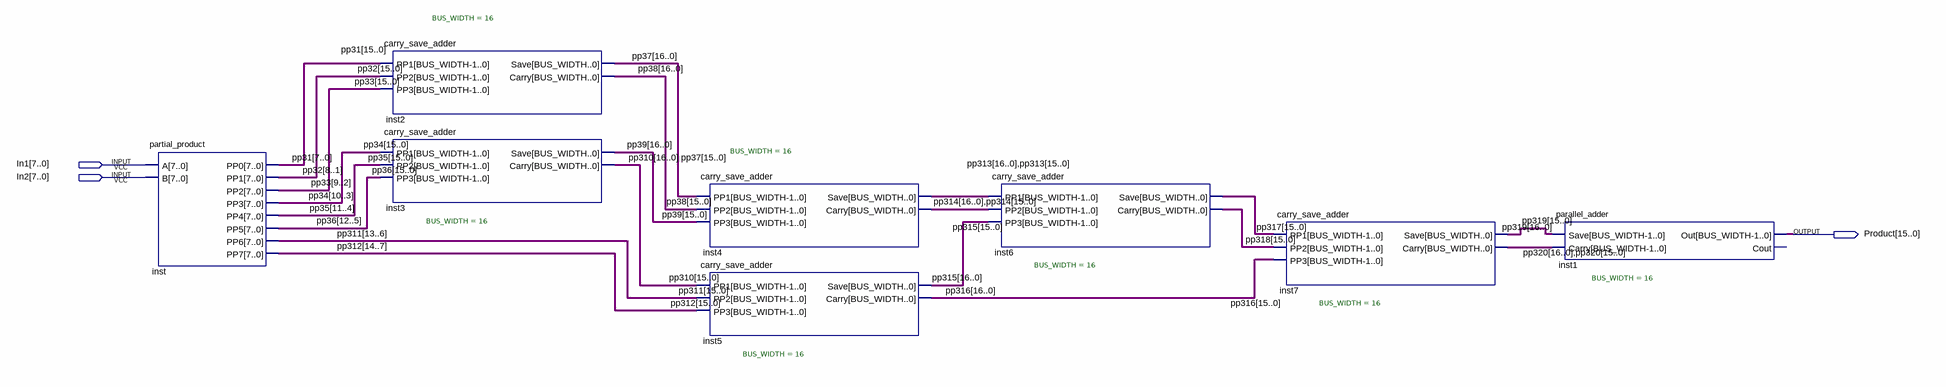
[diagram p0: schematic sheet]
// Quartus schematic wallace.bdf as structural Verilog: 8 symbols, 3 pins
module wallace (
  input  [7:0] In1,
  input  [7:0] In2,
  output [15:0] Product
);

  wire [15:0] pp31, pp32, pp33, pp34, pp35, pp36, pp311, pp312, pp317, pp318;
  wire [16:0] pp37, pp38, pp39, pp310, pp313, pp314, pp315, pp316, pp319, pp320;

  partial_product inst (
    .A(In1), .B(In2), .PP0(pp31[7:0]), .PP1(pp32[8:1]), .PP2(pp33[9:2]), .PP3(pp34[10:3]), .PP4(pp35[11:4]),
    .PP5(pp36[12:5]), .PP6(pp311[13:6]), .PP7(pp312[14:7]));
  carry_save_adder #(.BUS_WIDTH(16)) inst2 (.PP1(pp31), .PP2(pp32), .PP3(pp33), .Save(pp37), .Carry(pp38));
  carry_save_adder #(.BUS_WIDTH(16)) inst3 (.PP1(pp34), .PP2(pp35), .PP3(pp36), .Save(pp39), .Carry(pp310));
  carry_save_adder #(.BUS_WIDTH(16)) inst4 (
    .PP1(pp37[15:0]), .PP2(pp38[15:0]), .PP3(pp39[15:0]), .Save({pp313, pp313[15:0]}),
    .Carry({pp314, pp314[15:0]}));
  carry_save_adder #(.BUS_WIDTH(16)) inst5 (.PP1(pp310[15:0]), .PP2(pp311), .PP3(pp312), .Save(pp315), .Carry(pp316));
  carry_save_adder #(.BUS_WIDTH(16)) inst6 (
    .PP1({pp313, pp313[15:0]}), .PP2({pp314, pp314[15:0]}), .PP3(pp315[15:0]), .Save(pp317), .Carry(pp318));
  carry_save_adder #(.BUS_WIDTH(16)) inst7 (
    .PP1(pp317), .PP2(pp318), .PP3(pp316[15:0]), .Save(pp319), .Carry({pp320, pp320[15:0]}));
  parallel_adder #(.BUS_WIDTH(16)) inst1 (
    .Save(pp319[15:0]), .Carry({pp320, pp320[15:0]}), .Out(Product));  // open: Cout
endmodule
